# Altium project NodeReceive.PrjPcb
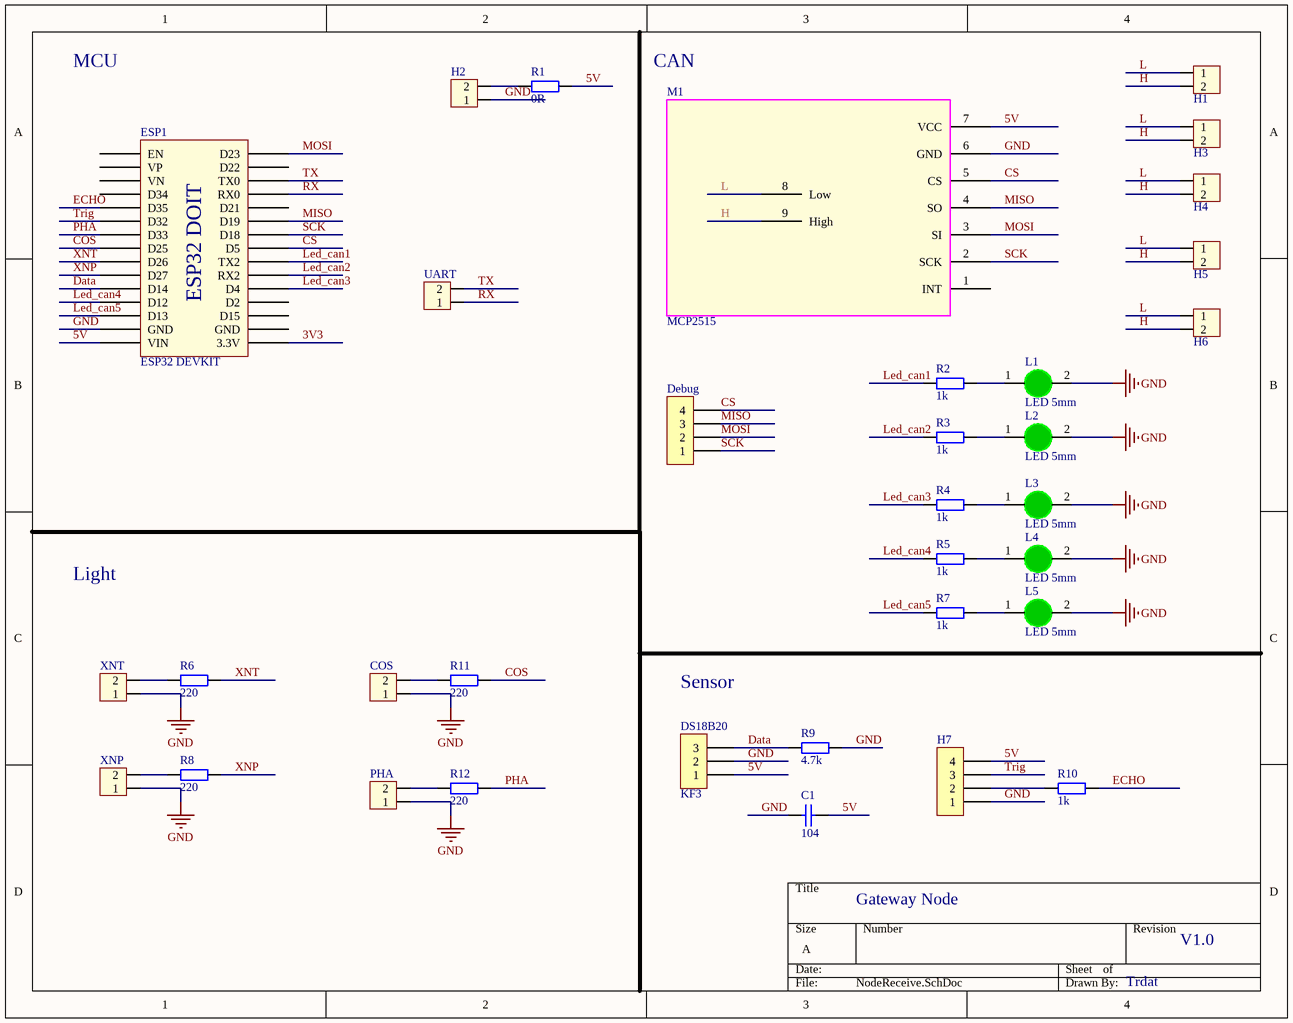
[diagram p0: NodeReceive.SchDoc]
1 sheet, 34 parts. Net scope: global (net labels, ports and power ports of the same name join across sheets).
Board file: NodeReceive.PcbDoc

## Sheet NodeReceive.SchDoc: Gateway Node
size A; DrawnBy: Trdat; Revision: V1.0; PageSetup: Record=PageOptions|CenterHorizontal=True|CenterVertical=True|PrintScale=1.00|XCorrection=1.00|YCorrection=1.00|PrintKind=0|BorderSize=5000000|LeftOffset=0|BottomOffset=0|Orientation=2|PaperLength=1000|PaperWidth=1000|Scale=100|PaperSource=7|PrintQuality=-3|MediaType=1|DitherType=10|PrintScaleMode=0|PaperKind=A4|PaperIndex=9

### Parts
C1  104  [tu gom]
COS  Header 2P 2.54 Duc Cong  [Header 2P DC 2.54]  (value not drawn)
Debug  Header 4P 2.54 Duc Cong  [Header 4P DC 2.54]  (value not drawn)
DS18B20  KF3  [KF3-5.08]
ESP1  ESP32 DEVKIT  [ESP32 WROOM 32 KIT]
H1  Header 2P 2.54 Duc Cong  [Header 2P DC 2.54]  (value not drawn)
H2  Header 2P 2.54 Duc Cong  [Header 2P DC 2.54]  (value not drawn)
H3  Header 2P 2.54 Duc Cong  [Header 2P DC 2.54]  (value not drawn)
H4  Header 2P 2.54 Duc Cong  [Header 2P DC 2.54]  (value not drawn)
H5  Header 2P 2.54 Duc Cong  [Header 2P DC 2.54]  (value not drawn)
H6  Header 2P 2.54 Duc Cong  [Header 2P DC 2.54]  (value not drawn)
H7  Header 4P 2.54 Duc Cong  [Header 4P DC 2.54]  (value not drawn)
L1  LED 5mm  [LED-5MM-Green]
L2  LED 5mm  [LED-5MM-Green]
L3  LED 5mm  [LED-5MM-Green]
L4  LED 5mm  [LED-5MM-Green]
L5  LED 5mm  [LED-5MM-Green]
M1  MCP2515  [MCP2515_MODULE]
PHA  Header 2P 2.54 Duc Cong  [Header 2P DC 2.54]  (value not drawn)
R1  0R  [tro vach 1/4w]
R2  1k  [tro vach 1/4w]
R3  1k  [tro vach 1/4w]
R4  1k  [tro vach 1/4w]
R5  1k  [tro vach 1/4w]
R6  220  [tro vach 1/4w]
R7  1k  [tro vach 1/4w]
R8  220  [tro vach 1/4w]
R9  4.7k  [tro vach 1/4w]
R10  1k  [tro vach 1/4w]
R11  220  [tro vach 1/4w]
R12  220  [tro vach 1/4w]
UART  Header 2P 2.54 Duc Cong  [Header 2P DC 2.54]  (value not drawn)
XNP  Header 2P 2.54 Duc Cong  [Header 2P DC 2.54]  (value not drawn)
XNT  Header 2P 2.54 Duc Cong  [Header 2P DC 2.54]  (value not drawn)

### Nets
GND: C1.2 COS.1 DS18B20.2 ESP1.14(GND) H2.1 H7.1 L1.2(K) L2.2(K) L3.2(K) L4.2(K) L5.2(K) M1.6(GND) PHA.1 R9.2 XNP.1 XNT.1
3V3: ESP1.16(3.3V)
5V: C1.1 DS18B20.1 ESP1.15(VIN) H7.4 M1.7(VCC) R1.2
COS: ESP1.8(D25) R11.1
CS: Debug.4 ESP1.23(D5) M1.5(CS)
Data: DS18B20.3 ESP1.11(D14) R9.1
ECHO: ESP1.5(D35) R10.2
H: H1.2 H3.2 H4.2 H5.2 H6.2 M1.9(High)
L: H1.1 H3.1 H4.1 H5.1 H6.1 M1.8(Low)
Led_can1: ESP1.22(TX2) R2.1
Led_can2: ESP1.21(RX2) R3.1
Led_can3: ESP1.20(D4) R4.1
Led_can4: ESP1.12(D12) R5.1
Led_can5: ESP1.13(D13) R7.1
MISO: Debug.3 ESP1.25(D19) M1.4(SO)
MOSI: Debug.2 ESP1.30(D23) M1.3(SI)
PHA: ESP1.7(D33) R12.1
RX: ESP1.27(RX0) UART.1
SCK: Debug.1 ESP1.24(D18) M1.2(SCK)
Trig: ESP1.6(D32) H7.3
TX: ESP1.28(TX0) UART.2
XNP: ESP1.10(D27) R8.1
XNT: ESP1.9(D26) R6.1
NetCOS_2: COS.2 R11.2
NetH2_2: H2.2 R1.1
NetH7_2: H7.2 R10.1
NetL1_1: L1.1(A) R2.2
NetL2_1: L2.1(A) R3.2
NetL3_1: L3.1(A) R4.2
NetL4_1: L4.1(A) R5.2
NetL5_1: L5.1(A) R7.2
NetPHA_2: PHA.2 R12.2
NetR6_2: R6.2 XNT.2
NetR8_2: R8.2 XNP.2

Not connected (* = marked no-connect by the designer): ESP1 1(EN) 2(VP) 3(VN) 4(D34) 17(GND) 18(D15) 19(D2) 26(D21) 29(D22); M1 1(INT)

### Notes on the sheet
- MCU
- CAN
- Light
- Sensor
- (in symbol ESP32 WROOM 32 KIT) ESP32 DOIT

### Library data of the parts
C1 = Tu gom 104 50V: Cắm; So_Chan: 2; Ten_Linh_Kien: Tụ gốm 104 100nF 50V; Don_Vi: Con; Ma_Hang: MH004761; Chung_Loai: Cắm; Kieu_Chan: *
COS H1-H6 PHA UART XNP XNT = Header 2P 2.54 Duc Cong: Cắm; Ten_Linh_Kien: Header 2P XH2.54-2P Đực Cong; Don_Vi: Con; Ma_Hang: MH002852; Chung_Loai: Cắm
Debug H7 = Header 4P 2.54 Duc Cong: Cắm; Ten_Linh_Kien: Header 4P XH2.54-4P Đực Cong; Don_Vi: Con; Ma_Hang: MH001310; Chung_Loai: Cắm
DS18B20 = KF3: Manufacturer: Würth Elektronik eiSos GmbH; partNo: 691103110003; ComponentLink1 Description: Manufacturer; ComponentLink2 Description: Datasheet; NoPins: 3; Created Date: 29 October 2013; ComponentLink1URL: http://www.we-online.com; ComponentLink2URL: http://katalog.we-online.de/em/datasheet/6911031100xx.pdf; Created by: Karrer Zheng
ESP1 = ESP32 WROOM 32 KIT
L1-L5 = LED 5mm Xanh La: Cắm; Don_Vi: Con; Ma_Hang: MH008969; Ten_Linh_Kien: LED 5MM Phủ Xanh (1000c); Ghi_Chu: *; Kieu_Chan: *; Chung_Loai: Cắm
R1 = Tro Vach 1/4W 5% 0.11R: Cắm; Don_Vi: Con; So_Chan: 2; Ten_Linh_Kien: Trở Vạch 1/4w 5% 0.11R; Ma_Hang: MH005220; Chung_Loai: Cắm; Kieu_Chan: *
R2-R8 R10-R12 = Tro Vach 1/4W 5% 1k: Cắm; Don_Vi: Con; So_Chan: 2; Ten_Linh_Kien: Trở Vạch 1/4w 5% 1k; Ma_Hang: MH007390; Chung_Loai: Cắm; Kieu_Chan: *
R9 = Tro Vach 1/4W 5% 4.7k: Cắm; Don_Vi: Con; So_Chan: 2; Ten_Linh_Kien: Trở Vạch 1/4w 5% 4.7k; Ma_Hang: MH007317; Chung_Loai: Cắm; Kieu_Chan: *